# EAGLE schematic schaltplan_v2 (EAGLE 6.4)
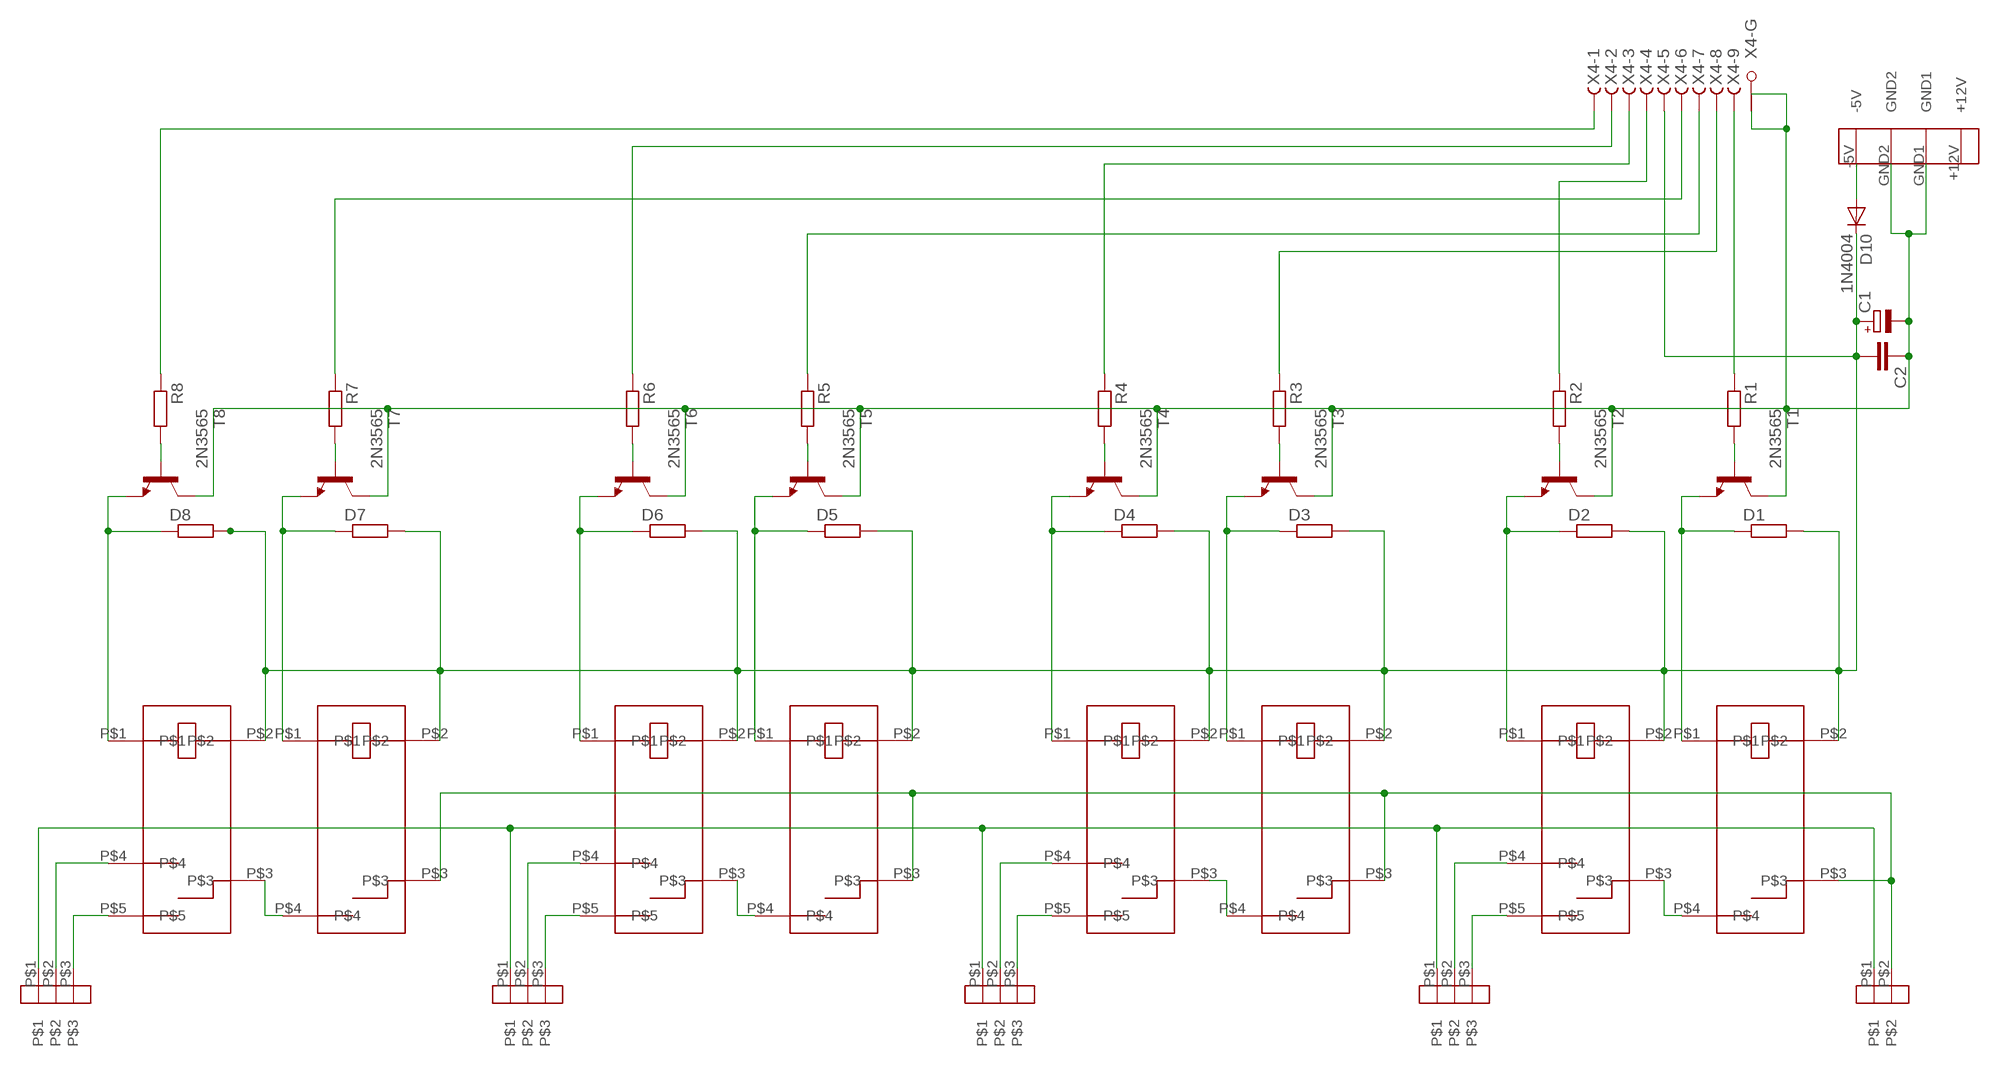
[diagram p0: schematic, sheet 1]

## Parts
C1  CPOL-EUE3.5-8  [E3,5-8]
C2  C-EU025-030X050  [C025-030X050]
D1  R-EU_0207/2V  [0207/2V]
D2  R-EU_0207/2V  [0207/2V]
D3  R-EU_0207/2V  [0207/2V]
D4  R-EU_0207/2V  [0207/2V]
D5  R-EU_0207/2V  [0207/2V]
D6  R-EU_0207/2V  [0207/2V]
D7  R-EU_0207/2V  [0207/2V]
D8  R-EU_0207/2V  [0207/2V]
D10  1N4004  [DO41-10]
R1  R-EU_0207/7  [0207/7]
R2  R-EU_0207/7  [0207/7]
R3  R-EU_0207/7  [0207/7]
R4  R-EU_0207/7  [0207/7]
R5  R-EU_0207/7  [0207/7]
R6  R-EU_0207/7  [0207/7]
R7  R-EU_0207/7  [0207/7]
R8  R-EU_0207/7  [0207/7]
T1  2N3565  [TO92]
T2  2N3565  [TO92]
T3  2N3565  [TO92]
T4  2N3565  [TO92]
T5  2N3565  [TO92]
T6  2N3565  [TO92]
T7  2N3565  [TO92]
T8  2N3565  [TO92]
U$1  JS_05_MN_KT  [JS_05_MN_KT]
U$2  JS_05_N_K  [JS_05_N_K]
U$3  JS_05_MN_KT  [JS_05_MN_KT]
U$4  JS_05_N_K  [JS_05_N_K]
U$5  JS_05_MN_KT  [JS_05_MN_KT]
U$6  JS_05_N_K  [JS_05_N_K]
U$7  JS_05_MN_KT  [JS_05_MN_KT]
U$8  JS_05_N_K  [JS_05_N_K]
U$9  WAGO_734_262  [WAGO_734_262]
U$10  WAGO_734_263  [WAGO_734_263]
U$11  WAGO_734_263  [WAGO_734_263]
U$12  WAGO_734_263  [WAGO_734_263]
U$13  WAGO_734_263  [WAGO_734_263]
U$14  PSW_5  [PSW_5]
X4  F09HPS  [F09HP]

## Nets
GND: C1.- C2.1 T1.1(C) T2.1(C) T3.1(C) T4.1(C) T5.1(C) T6.1(C) T7.1(C) T8.1(C) U$14.GND1 U$14.GND2 X4.G1(-G:G1) X4.G2(-G:G2)
GND2: U$9.P$1 U$10.P$1 U$11.P$1 U$12.P$1 U$13.P$1
N$2: U$2.P$5 U$10.P$3
N$3: U$2.P$4 U$10.P$2
N$4: U$1.P$4 U$2.P$3
N$5: U$1.P$3 U$3.P$3 U$5.P$3 U$7.P$3 U$9.P$2
N$6: D1.1 T1.3(E) U$1.P$1
N$7: D10.A U$14.-5V
N$8: R1.2 T1.2(B)
N$11: R5.1 X4.7(-7:F)
N$12: D2.1 T2.3(E) U$2.P$1
N$13: R6.2 T6.2(B)
N$14: R6.1 X4.2(-2:F)
N$15: R8.1 X4.1(-1:F)
N$16: U$4.P$5 U$11.P$3
N$17: U$4.P$4 U$11.P$2
N$18: U$3.P$4 U$4.P$3
N$20: D3.1 T3.3(E) U$3.P$1
N$21: R7.1 X4.6(-6:F)
N$22: R3.2 T3.2(B)
N$23: R4.1 X4.3(-3:F)
N$24: C1.+ C2.2 D1.2 D2.2 D3.2 D4.2 D5.2 D6.2 D7.2 D8.2 D10.C U$1.P$2 U$2.P$2 U$3.P$2 U$4.P$2 U$5.P$2 U$6.P$2 U$7.P$2 U$8.P$2 X4.5(-5:F)
N$25: D4.1 T4.3(E) U$4.P$1
N$26: R2.1 X4.4(-4:F)
N$27: R2.2 T2.2(B)
N$28: R4.2 T4.2(B)
N$30: U$6.P$5 U$12.P$3
N$31: U$6.P$4 U$12.P$2
N$32: U$5.P$4 U$6.P$3
N$34: D5.1 T5.3(E) U$5.P$1
N$36: R5.2 T5.2(B)
N$37: R3.1 X4.8(-8:F)
N$38: R1.1 X4.9(-9:F)
N$39: D6.1 T6.3(E) U$6.P$1
N$40: R8.2 T8.2(B)
N$42: U$8.P$5 U$13.P$3
N$43: U$8.P$4 U$13.P$2
N$44: U$7.P$4 U$8.P$3
N$46: D7.1 T7.3(E) U$7.P$1
N$48: R7.2 T7.2(B)
N$51: D8.1 T8.3(E) U$8.P$1
Unconnected: U$14.+12V

## Library data of the parts
C1 = rcl:CPOL-EU: POLARIZED CAPACITOR, European symbol
C2 = rcl:C-EU: CAPACITOR, European symbol
D1-D8 R1-R8 = rcl:R-EU_: RESISTOR, European symbol
D10 = diode:1N4004: DIODE general purpose rectifier, 1 A
T1-T8 = transistor:2N3565: NPN TRANSISTOR
U$1 U$3 U$5 U$7 = n39:JS_05_MN_KT
U$2 U$4 U$6 U$8 = n39:JS_05_N_K: Schaltrelais JK 05 N K http://www.reichelt.de/Print-Steckrelais/JS-05-N-K/3//index.html?ACTION=3&GROUPID=3293&ARTICLE=79414&SHOW=1&START=0&OFFSET=16&
U$9 = n39:WAGO_734_262: WAGO 743-262 Print-Stiftleiste, Mini, RM 3,81, gewinkelt, 2-polig http://www.reichelt.de/WAGO-Stecksysteme/WAGO-734-262/3/index.html?;ACTION=3;LA=446;ARTICLE=45978;GROUPID=5690;artnr=WAGO+734-262;SID=11UOMKs38AAAIAABbvFEc5b11be4da1ac9cc045b827e422a49e7b
U$10-U$13 = n39:WAGO_734_263: WAGO 734-263 Print-Stiftleiste, Mini, RM 3,81, gewinkelt, 3-polig http://www.reichelt.de/WAGO-Stecksysteme/WAGO-734-263/3/index.html?;ACTION=3;LA=446;ARTICLE=45980;GROUPID=5690;artnr=WAGO+734-263;SID=11UOMKs38AAAIAABbvFEc5b11be4da1ac9cc045b827e422a49e7b
U$14 = n39:PSW_5: PSW 5 Stromversorgungsstecker f. 5 1/4 Zoll, Print, gew. http://www.reichelt.de/Floppy-Powerstecker/PSW-5/3/index.html?;ACTION=3;LA=446;ARTICLE=14915;GROUPID=3257;artnr=PSW+5;SID=11UOMKs38AAAIAABbvFEc5b11be4da1ac9cc045b827e422a49e7b
X4 = con-subd:F09HPS: SUB-D; OC_FARNELL: unknown; OC_NEWARK: unknown